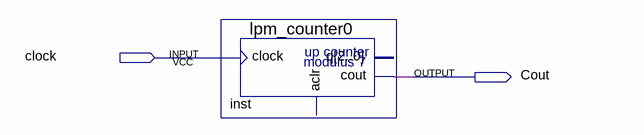
[diagram p0: schematic sheet]
// Quartus schematic pruebacontador.bdf as structural Verilog: 1 symbols, 2 pins
module pruebacontador (
  input  clock,
  output Cout
);

  lpm_counter0 inst (.clock(clock), .cout(Cout));  // open: aclr, q
endmodule
